# EAGLE design megamapper (EAGLE 6.5.0)
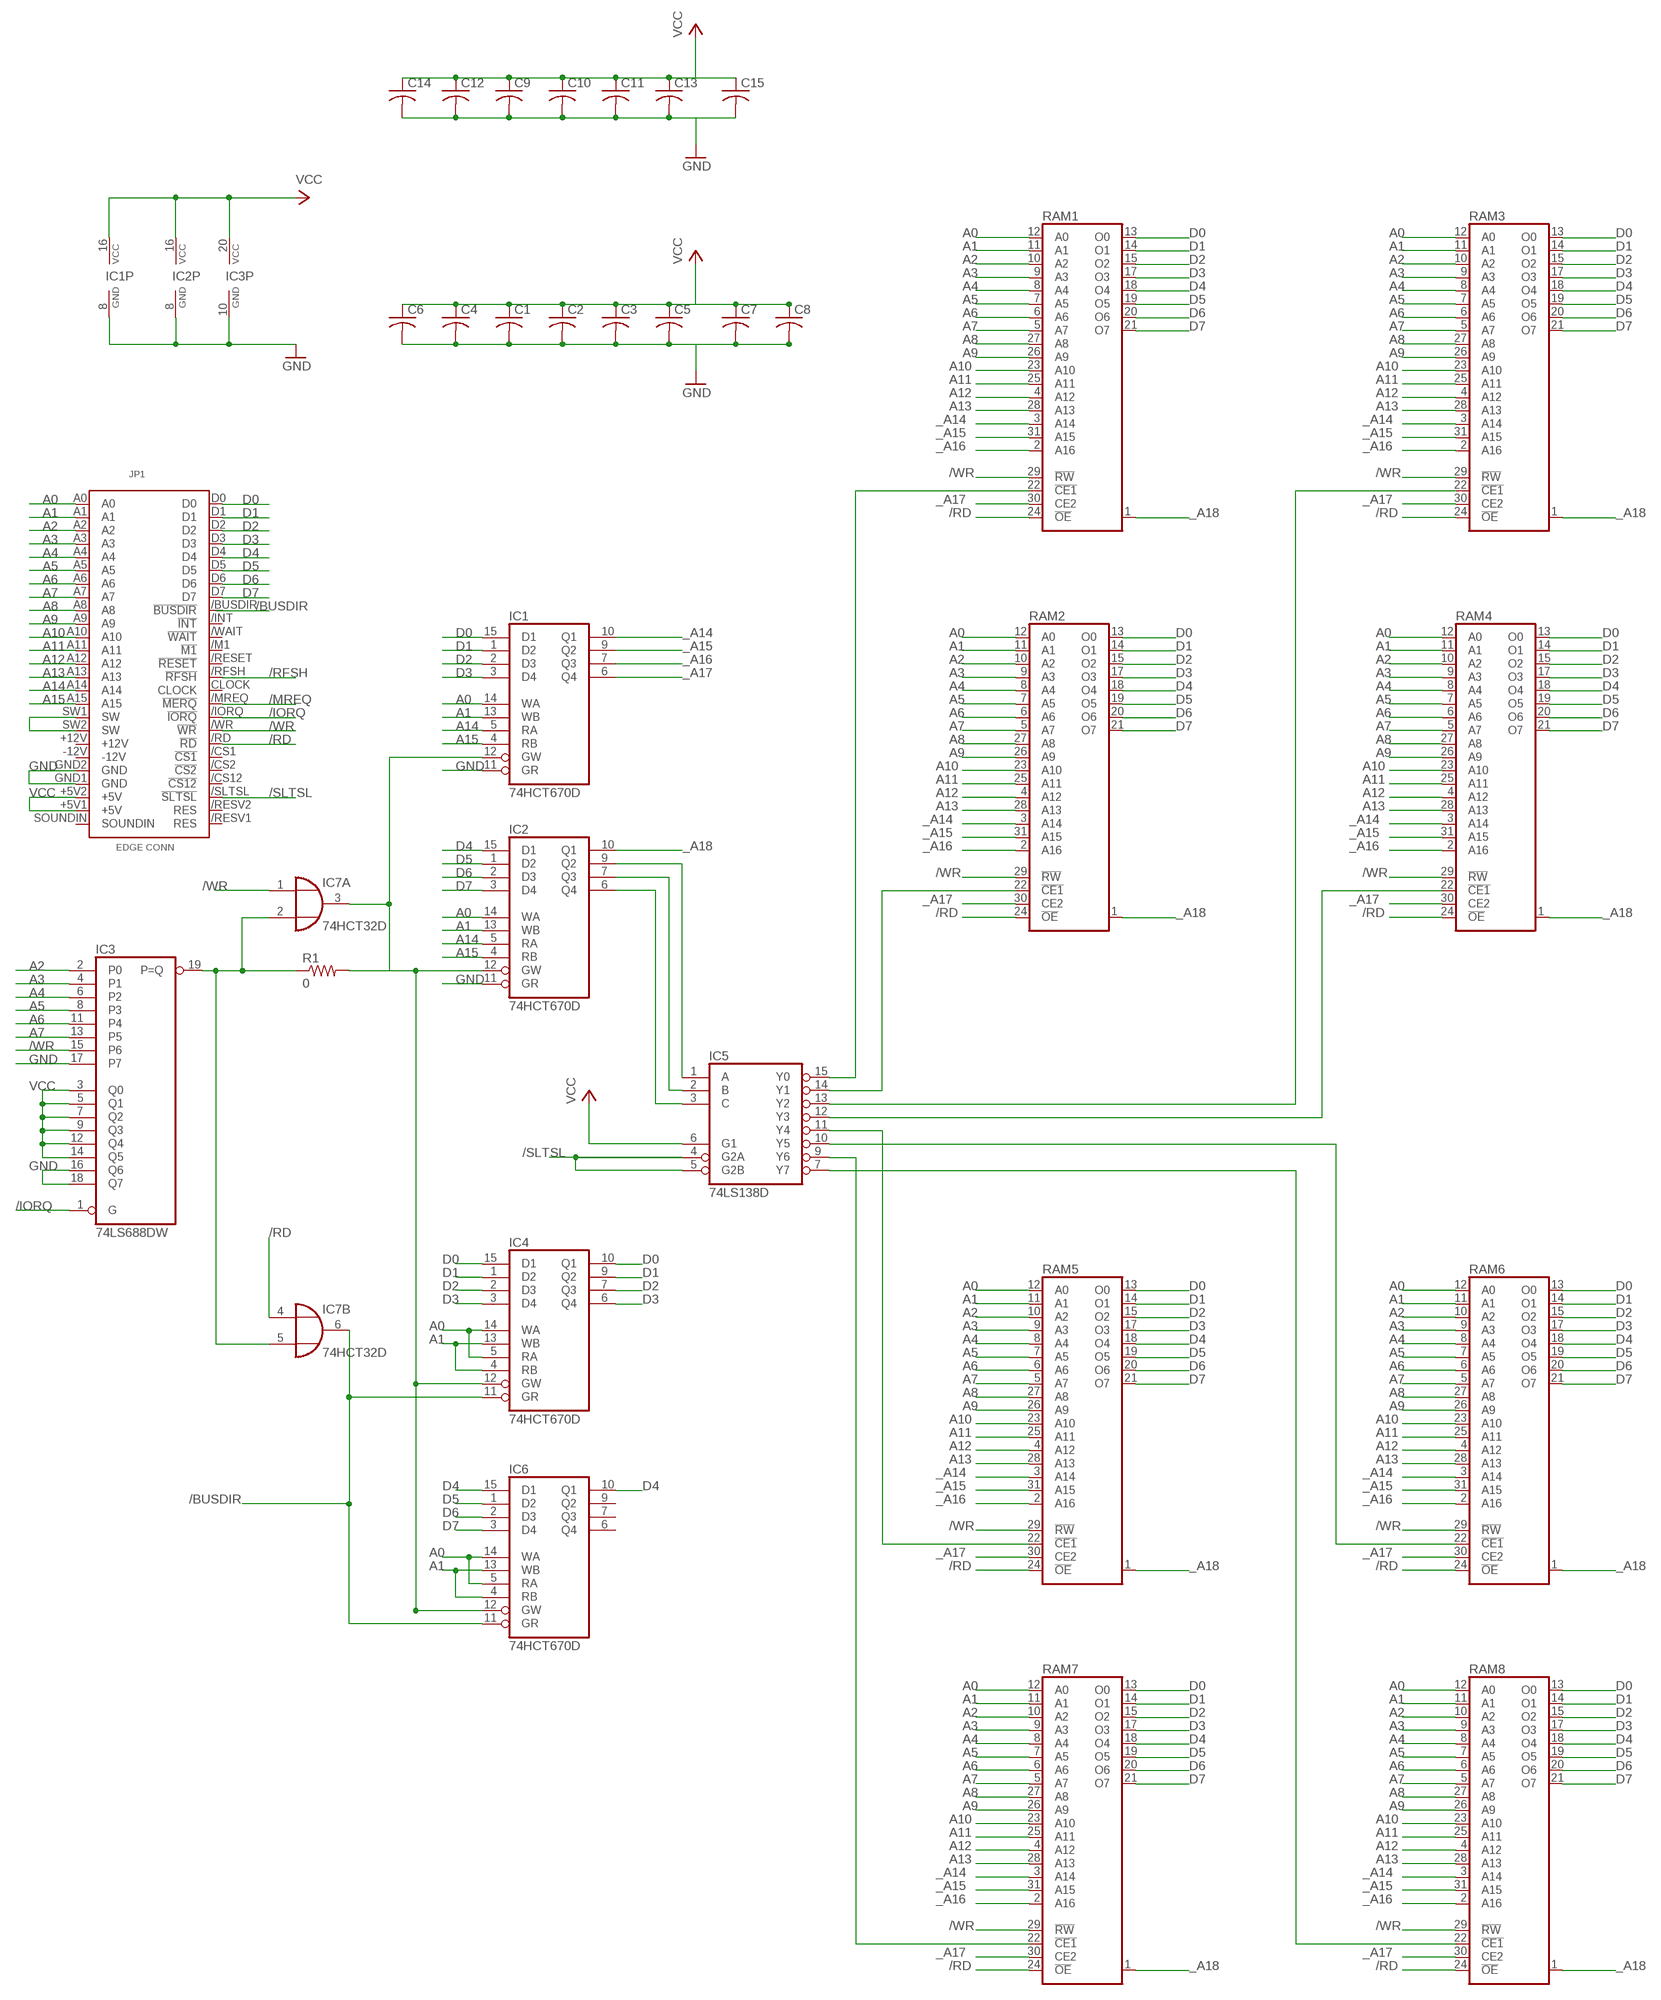
[diagram p0: schematic, sheet 1]

## Parts
C1  C-USC0805K  [C0805K]
C2  C-USC0805K  [C0805K]
C3  C-USC0805K  [C0805K]
C4  C-USC0805K  [C0805K]
C5  C-USC0805K  [C0805K]
C6  C-USC0805K  [C0805K]
C7  C-USC0805K  [C0805K]
C8  C-USC0805K  [C0805K]
C9  C-USC0805K  [C0805K]
C10  C-USC0805K  [C0805K]
C11  C-USC0805K  [C0805K]
C12  C-USC0805K  [C0805K]
C13  C-USC0805K  [C0805K]
C14  C-USC0805K  [C0805K]
C15  C-USC0805K  [C0805K]
IC1  74HCT670D  [SO16]
IC2  74HCT670D  [SO16]
IC3  74LS688DW  [SO20W]
IC4  74HCT670D  [SO16]
IC5  74LS138D  [SO16]
IC6  74HCT670D  [SO16]
IC7  74HCT32D  [SO14]
JP1  MSXCART  [MSXCART]
R1  0  R-US_R0805  [R0805]
RAM1  TC551001CF  [SOP32L]
RAM2  TC551001CF  [SOP32L]
RAM3  TC551001CF  [SOP32L]
RAM4  TC551001CF  [SOP32L]
RAM5  TC551001CF  [SOP32L]
RAM6  TC551001CF  [SOP32L]
RAM7  TC551001CF  [SOP32L]
RAM8  TC551001CF  [SOP32L]

## Nets
/BUSDIR: IC4.11(GR) IC6.11(GR) IC7.6(B:O)
/IORQ: IC3.1(G) JP1./IORQ(!IORQ)
/MREQ: JP1./MREQ(!MERQ)
/RD: IC7.4(B:I0) JP1./RD(!RD) RAM1.24(!OE) RAM2.24(!OE) RAM3.24(!OE) RAM4.24(!OE) RAM5.24(!OE) RAM6.24(!OE) RAM7.24(!OE) RAM8.24(!OE)
/RFSH: JP1./RFSH(!RFSH)
/SLTSL: IC5.4(G2A) IC5.5(G2B) JP1./SLTSL(!SLTSL)
/WR: IC3.15(P6) IC7.1(A:I0) JP1./WR(!WR) RAM1.29(!RW) RAM2.29(!RW) RAM3.29(!RW) RAM4.29(!RW) RAM5.29(!RW) RAM6.29(!RW) RAM7.29(!RW) RAM8.29(!RW)
_A14: IC1.10(Q1) RAM1.3(A14) RAM2.3(A14) RAM3.3(A14) RAM4.3(A14) RAM5.3(A14) RAM6.3(A14) RAM7.3(A14) RAM8.3(A14)
_A15: IC1.9(Q2) RAM1.31(A15) RAM2.31(A15) RAM3.31(A15) RAM4.31(A15) RAM5.31(A15) RAM6.31(A15) RAM7.31(A15) RAM8.31(A15)
_A16: IC1.7(Q3) RAM1.2(A16) RAM2.2(A16) RAM3.2(A16) RAM4.2(A16) RAM5.2(A16) RAM6.2(A16) RAM7.2(A16) RAM8.2(A16)
_A17: IC1.6(Q4) RAM1.30(CE2) RAM2.30(CE2) RAM3.30(CE2) RAM4.30(CE2) RAM5.30(CE2) RAM6.30(CE2) RAM7.30(CE2) RAM8.30(CE2)
_A18: IC2.10(Q1) RAM1.1(NC) RAM2.1(NC) RAM3.1(NC) RAM4.1(NC) RAM5.1(NC) RAM6.1(NC) RAM7.1(NC) RAM8.1(NC)
A0: IC1.14(WA) IC2.14(WA) IC4.5(RA) IC4.14(WA) IC6.5(RA) IC6.14(WA) JP1.A0 RAM1.12(A0) RAM2.12(A0) RAM3.12(A0) RAM4.12(A0) RAM5.12(A0) RAM6.12(A0) RAM7.12(A0) RAM8.12(A0)
A1: IC1.13(WB) IC2.13(WB) IC4.4(RB) IC4.13(WB) IC6.4(RB) IC6.13(WB) JP1.A1 RAM1.11(A1) RAM2.11(A1) RAM3.11(A1) RAM4.11(A1) RAM5.11(A1) RAM6.11(A1) RAM7.11(A1) RAM8.11(A1)
A2: IC3.2(P0) JP1.A2 RAM1.10(A2) RAM2.10(A2) RAM3.10(A2) RAM4.10(A2) RAM5.10(A2) RAM6.10(A2) RAM7.10(A2) RAM8.10(A2)
A3: IC3.4(P1) JP1.A3 RAM1.9(A3) RAM2.9(A3) RAM3.9(A3) RAM4.9(A3) RAM5.9(A3) RAM6.9(A3) RAM7.9(A3) RAM8.9(A3)
A4: IC3.6(P2) JP1.A4 RAM1.8(A4) RAM2.8(A4) RAM3.8(A4) RAM4.8(A4) RAM5.8(A4) RAM6.8(A4) RAM7.8(A4) RAM8.8(A4)
A5: IC3.8(P3) JP1.A5 RAM1.7(A5) RAM2.7(A5) RAM3.7(A5) RAM4.7(A5) RAM5.7(A5) RAM6.7(A5) RAM7.7(A5) RAM8.7(A5)
A6: IC3.11(P4) JP1.A6 RAM1.6(A6) RAM2.6(A6) RAM3.6(A6) RAM4.6(A6) RAM5.6(A6) RAM6.6(A6) RAM7.6(A6) RAM8.6(A6)
A7: IC3.13(P5) JP1.A7 RAM1.5(A7) RAM2.5(A7) RAM3.5(A7) RAM4.5(A7) RAM5.5(A7) RAM6.5(A7) RAM7.5(A7) RAM8.5(A7)
A8: JP1.A8 RAM1.27(A8) RAM2.27(A8) RAM3.27(A8) RAM4.27(A8) RAM5.27(A8) RAM6.27(A8) RAM7.27(A8) RAM8.27(A8)
A9: JP1.A9 RAM1.26(A9) RAM2.26(A9) RAM3.26(A9) RAM4.26(A9) RAM5.26(A9) RAM6.26(A9) RAM7.26(A9) RAM8.26(A9)
A10: JP1.A10 RAM1.23(A10) RAM2.23(A10) RAM3.23(A10) RAM4.23(A10) RAM5.23(A10) RAM6.23(A10) RAM7.23(A10) RAM8.23(A10)
A11: JP1.A11 RAM1.25(A11) RAM2.25(A11) RAM3.25(A11) RAM4.25(A11) RAM5.25(A11) RAM6.25(A11) RAM7.25(A11) RAM8.25(A11)
A12: JP1.A12 RAM1.4(A12) RAM2.4(A12) RAM3.4(A12) RAM4.4(A12) RAM5.4(A12) RAM6.4(A12) RAM7.4(A12) RAM8.4(A12)
A13: JP1.A13 RAM1.28(A13) RAM2.28(A13) RAM3.28(A13) RAM4.28(A13) RAM5.28(A13) RAM6.28(A13) RAM7.28(A13) RAM8.28(A13)
A14: IC1.5(RA) IC2.5(RA) JP1.A14
A15: IC1.4(RB) IC2.4(RB) JP1.A15
D0: IC1.15(D1) IC4.10(Q1) IC4.15(D1) JP1.D0 RAM1.13(O0) RAM2.13(O0) RAM3.13(O0) RAM4.13(O0) RAM5.13(O0) RAM6.13(O0) RAM7.13(O0) RAM8.13(O0)
D1: IC1.1(D2) IC4.1(D2) IC4.9(Q2) JP1.D1 RAM1.14(O1) RAM2.14(O1) RAM3.14(O1) RAM4.14(O1) RAM5.14(O1) RAM6.14(O1) RAM7.14(O1) RAM8.14(O1)
D2: IC1.2(D3) IC4.2(D3) IC4.7(Q3) JP1.D2 RAM1.15(O2) RAM2.15(O2) RAM3.15(O2) RAM4.15(O2) RAM5.15(O2) RAM6.15(O2) RAM7.15(O2) RAM8.15(O2)
D3: IC1.3(D4) IC4.3(D4) IC4.6(Q4) JP1.D3 RAM1.17(O3) RAM2.17(O3) RAM3.17(O3) RAM4.17(O3) RAM5.17(O3) RAM6.17(O3) RAM7.17(O3) RAM8.17(O3)
D4: IC2.15(D1) IC6.10(Q1) IC6.15(D1) JP1.D4 RAM1.18(O4) RAM2.18(O4) RAM3.18(O4) RAM4.18(O4) RAM5.18(O4) RAM6.18(O4) RAM7.18(O4) RAM8.18(O4)
D5: IC2.1(D2) IC6.1(D2) JP1.D5 RAM1.19(O5) RAM2.19(O5) RAM3.19(O5) RAM4.19(O5) RAM5.19(O5) RAM6.19(O5) RAM7.19(O5) RAM8.19(O5)
D6: IC2.2(D3) IC6.2(D3) JP1.D6 RAM1.20(O6) RAM2.20(O6) RAM3.20(O6) RAM4.20(O6) RAM5.20(O6) RAM6.20(O6) RAM7.20(O6) RAM8.20(O6)
D7: IC2.3(D4) IC6.3(D4) JP1.D7 RAM1.21(O7) RAM2.21(O7) RAM3.21(O7) RAM4.21(O7) RAM5.21(O7) RAM6.21(O7) RAM7.21(O7) RAM8.21(O7)
GND [GND]: C1.2 C2.2 C3.2 C4.2 C5.2 C6.2 C7.2 C8.2 C9.2 C10.2 C11.2 C12.2 C13.2 C14.2 C15.2 IC1.8(GND) IC1.11(GR) IC2.8(GND) IC2.11(GR) IC3.10(GND) IC3.16(Q6) IC3.17(P7) IC3.18(Q7) JP1.GND1(GND) JP1.GND2(GND)
N$1: IC1.12(GW) IC2.12(GW) IC4.12(GW) IC6.12(GW) IC7.3(A:O) R1.2
N$2: IC5.14(Y1) RAM2.22(!CE1)
N$3: IC5.13(Y2) RAM3.22(!CE1)
N$4: IC5.12(Y3) RAM4.22(!CE1)
N$5: IC5.11(Y4) RAM5.22(!CE1)
N$6: IC5.10(Y5) RAM6.22(!CE1)
N$7: JP1.SW1(SW) JP1.SW2(SW)
N$8: IC2.9(Q2) IC5.1(A)
N$9: IC2.7(Q3) IC5.2(B)
N$10: IC2.6(Q4) IC5.3(C)
N$11: IC5.9(Y6) RAM7.22(!CE1)
N$12: IC5.7(Y7) RAM8.22(!CE1)
N$13: IC3.19(P=Q) IC7.2(A:I1) IC7.5(B:I1) R1.1
N$26: IC5.15(Y0) RAM1.22(!CE1)
VCC [VCC]: C1.1 C2.1 C3.1 C4.1 C5.1 C6.1 C7.1 C8.1 C9.1 C10.1 C11.1 C12.1 C13.1 C14.1 C15.1 IC1.16(VCC) IC2.16(VCC) IC3.3(Q0) IC3.5(Q1) IC3.7(Q2) IC3.9(Q3) IC3.12(Q4) IC3.14(Q5) IC3.20(VCC) IC5.6(G1) JP1.+5V1(+5V) JP1.+5V2(+5V)
Unconnected: IC6.6(Q4) IC6.7(Q3) IC6.9(Q2) IC7.8(C:O) IC7.9(C:I0) IC7.10(C:I1) IC7.11(D:O) IC7.12(D:I0) IC7.13(D:I1) JP1.+12V JP1.-12V JP1./BUSDIR(!BUSDIR) JP1./CS1(!CS1) JP1./CS2(!CS2) JP1./CS12(!CS12) JP1./INT(!INT) JP1./M1(!M1) JP1./RESET(!RESET) JP1./RESV1(RES) JP1./RESV2(RES) JP1./WAIT(!WAIT) JP1.CLOCK JP1.SOUNDIN

## Power pins joined to a net without a drawn wire
GND: IC4.8(GND) IC5.8(GND) IC6.8(GND) IC7.7(P:GND) RAM1.16(GND) RAM2.16(GND) RAM3.16(GND) RAM4.16(GND) RAM5.16(GND) RAM6.16(GND) RAM7.16(GND) RAM8.16(GND)
VCC: IC4.16(VCC) IC5.16(VCC) IC6.16(VCC) IC7.14(P:VCC) RAM1.32(VCC) RAM2.32(VCC) RAM3.32(VCC) RAM4.32(VCC) RAM5.32(VCC) RAM6.32(VCC) RAM7.32(VCC) RAM8.32(VCC)

## Library data of the parts
C1-C15 = adafruit:C-US: CAPACITOR, American symbol
IC1 IC2 IC4 IC6 = 74xx-eu:74*670: 4 by 4 REGISTER FILES, 3-state
IC3 = 74xx-eu:74*688: 8-bit MAGNITUDE/IDENTITY COMPARATOR, totem pole
IC5 = 74xx-eu:74*138: 3-line to 8-line DECODER/DEMULTIPLEXER
IC7 = 74xx-eu:74*32: Quad 2-input OR gate
JP1 = msx-con:MSXCART
R1 = adafruit:R-US_: RESISTOR, American symbol
RAM1-RAM8 = memory:TC551001CF: MEMORY

## Net classes
1 GND: width 0.406 mm
2 VCC: width 0.406 mm

## Board
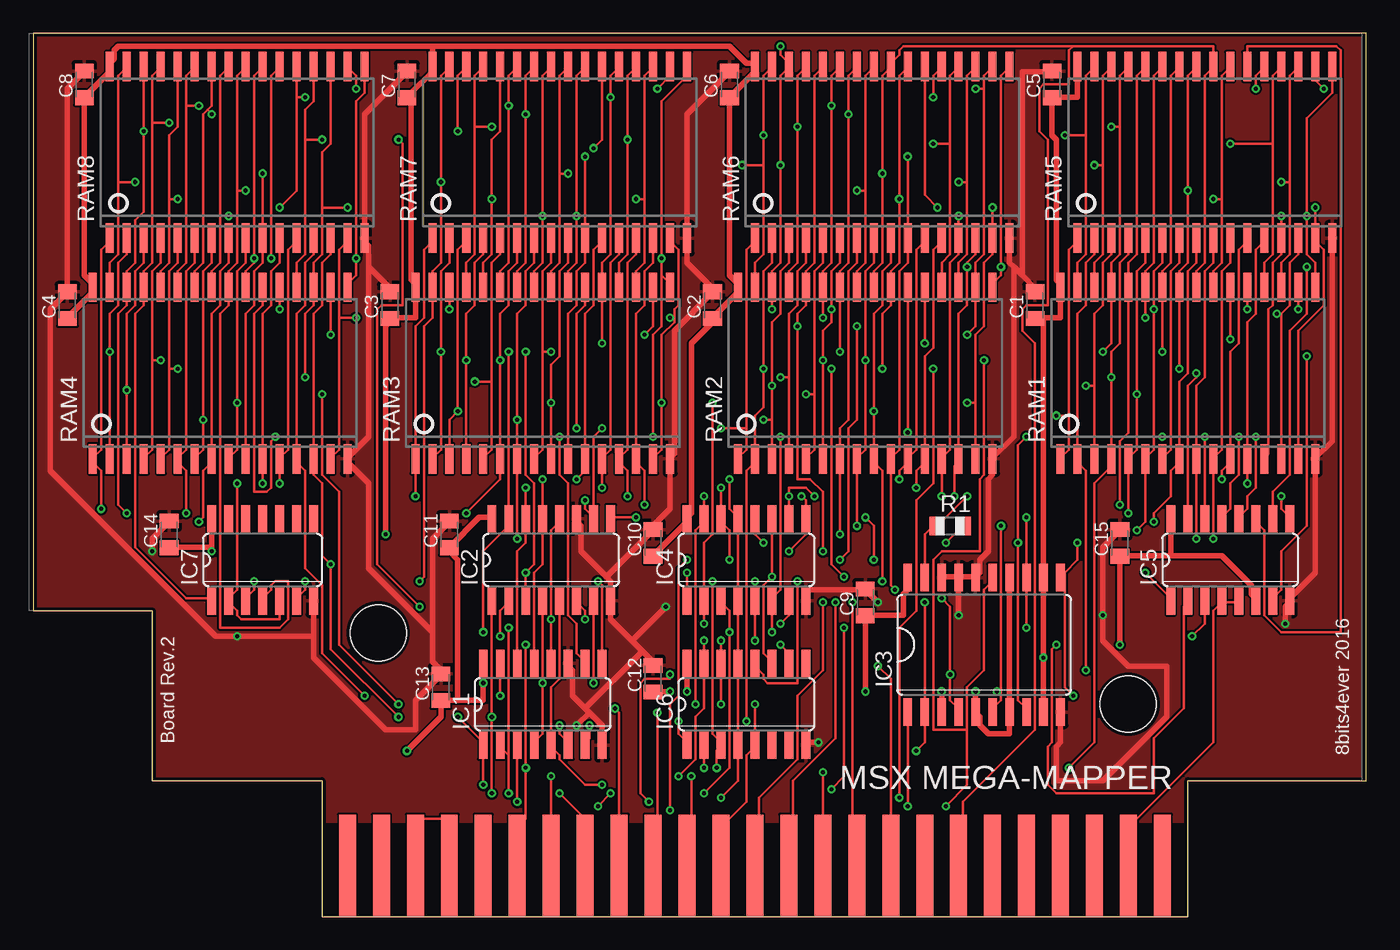
[diagram p1: board, top side]
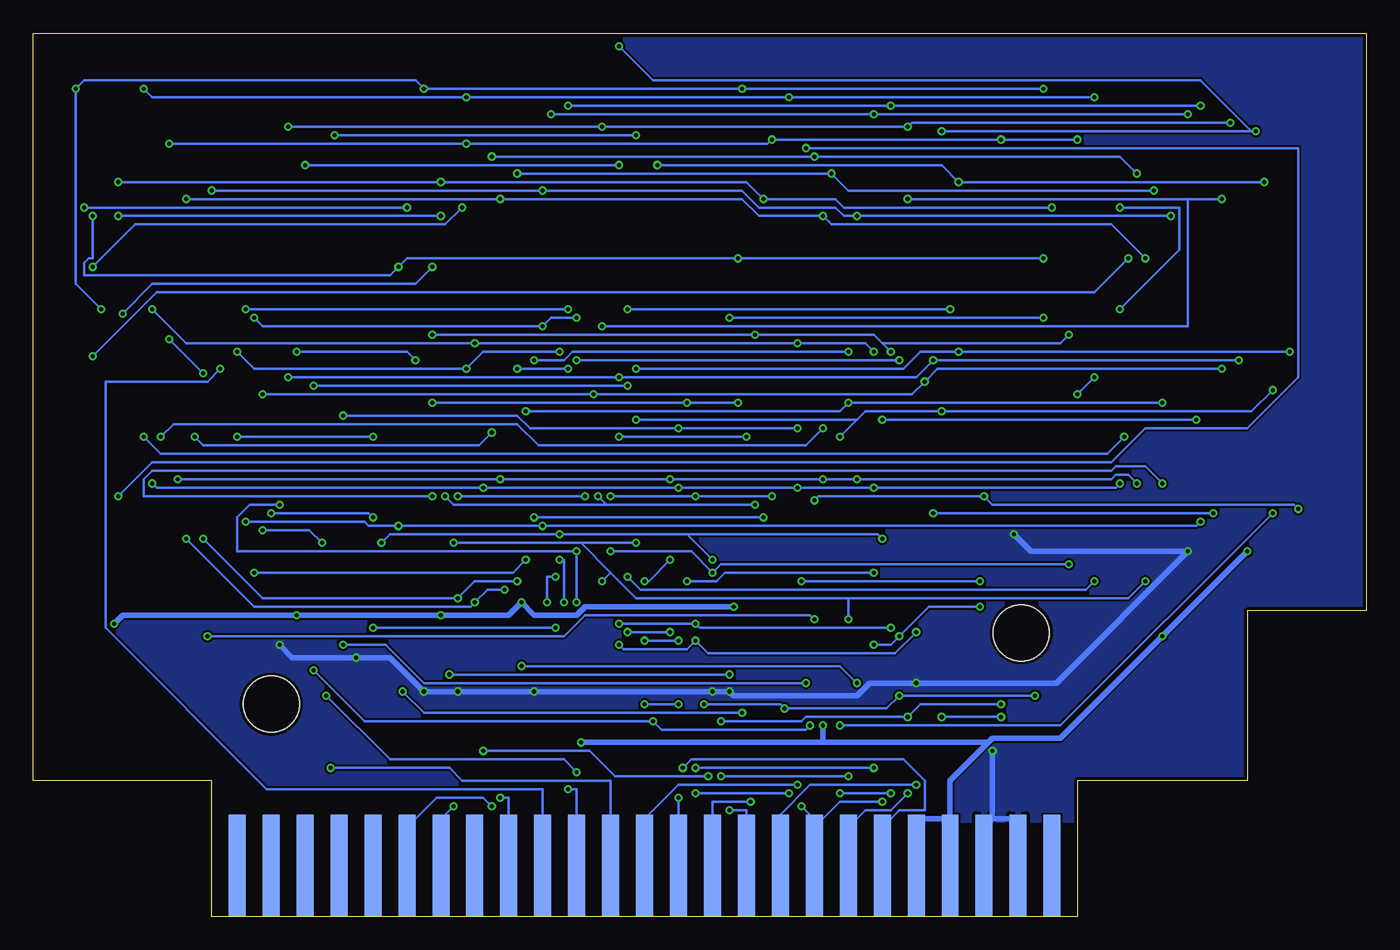
[diagram p2: board, bottom side, seen from below]

Size 99.69 x 66.04 mm. Coordinates in mm from the lower left corner, seen from the top.
Outline: 0,66.04 0,22.86 8.89,22.86 8.89,10.16 21.59,10.16 21.59,0 86.36,0 86.36,10.16 99.69,10.16 99.69,66.04 0,66.04
Copper layers (1*16): Top 0.035mm / dielectric 1.5mm / Bottom 0.035mm
Design rules "SeeedStudio_2layer_DRU_no_angle_20140221 *": minimum track width 7mil, minimum drill 12mil, track to track 6mil, track to pad 6mil, pad to pad 6mil, via to via 6mil, smd to smd 0mil, copper to edge 10mil, drill to drill 10mil, minimum pad ring 10mil, minimum via ring 6mil, stop-mask expansion 2mil, vias tented up to drill 100mil, thermal gap 10mil

### Footprints (pad centres in the part's own frame; a part is rotated, then mirrored left to right if it is on the bottom)
C0805K = smd 1.1 x 1.4: 1 -1,0; 2 1,0
SO16 = smd 0.66 x 2.032: 1 -4.445,-3.073; 2 -3.175,-3.073; 3 -1.905,-3.073; 4 -0.635,-3.073; 5 0.635,-3.073; 6 1.905,-3.073; 7 3.175,-3.073; 8 4.445,-3.073; 9 4.445,3.073; 10 3.175,3.073; 11 1.905,3.073; 12 0.635,3.073; 13 -0.635,3.073; 14 -1.905,3.073; 15 -3.175,3.073; 16 -4.445,3.073
SO20W = smd 0.66 x 2.032: 1 -5.715,-5.029; 2 -4.445,-5.029; 3 -3.175,-5.029; 4 -1.905,-5.029; 5 -0.635,-5.029; 6 0.635,-5.029; 7 1.905,-5.029; 8 3.175,-5.029; 9 4.445,-5.029; 10 5.715,-5.029; 11 5.715,5.029; 12 4.445,5.029; 13 3.175,5.029; 14 1.905,5.029; 15 0.635,5.029; 16 -0.635,5.029; 17 -1.905,5.029; 18 -3.175,5.029; 19 -4.445,5.029; 20 -5.715,5.029
SO14 = smd 0.66 x 2.032: 1 -3.81,-3.073; 2 -2.54,-3.073; 3 -1.27,-3.073; 4 0,-3.073; 5 1.27,-3.073; 6 2.54,-3.073; 7 3.81,-3.073; 8 3.81,3.073; 9 2.54,3.073; 10 1.27,3.073; 11 0,3.073; 12 -1.27,3.073; 13 -2.54,3.073; 14 -3.81,3.073
MSXCART = smd 1.27 x 7.62 bottom: +5V1 4.445,3.81; +5V2 6.985,3.81; /CS1 62.865,3.81; /CS12 60.325,3.81; /IORQ 50.165,3.81; /M1 52.705,3.81; /RESET 45.085,3.81; /RESV2 57.785,3.81; /WAIT 55.245,3.81; /WR 47.625,3.81; A1 29.845,3.81; A3 27.305,3.81; A5 24.765,3.81; A7 37.465,3.81; A9 42.545,3.81; A11 40.005,3.81; A12 34.925,3.81; A14 32.385,3.81; D1 22.225,3.81; D3 19.685,3.81; D5 17.145,3.81; D7 14.605,3.81; GND1 9.525,3.81; GND2 12.065,3.81; SOUNDIN 1.905,3.81 | smd 1.27 x 7.62: +12V 4.445,3.81; -12V 1.905,3.81; /BUSDIR 52.705,3.81; /CS2 62.865,3.81; /INT 55.245,3.81; /MREQ 50.165,3.81; /RD 47.625,3.81; /RESV1 45.085,3.81; /RFSH 57.785,3.81; /SLTSL 60.325,3.81; A0 29.845,3.81; A2 27.305,3.81; A4 24.765,3.81; A6 37.465,3.81; A8 34.925,3.81; A10 40.005,3.81; A13 32.385,3.81; A15 42.545,3.81; CLOCK 12.065,3.81; D0 22.225,3.81; D2 19.685,3.81; D4 17.145,3.81; D6 14.605,3.81; SW1 9.525,3.81; SW2 6.985,3.81 | hole 4.2: 60.312,15.887; 4.206,21.218
R0805 = smd 1.1 x 1.4: 1 -1,0; 2 1,0
SOP32L = smd 0.6 x 2.2: 1 -9.525,-6.416; 2 -8.255,-6.416; 3 -6.985,-6.416; 4 -5.715,-6.416; 5 -4.445,-6.416; 6 -3.175,-6.416; 7 -1.905,-6.416; 8 -0.635,-6.416; 9 0.635,-6.416; 10 1.905,-6.416; 11 3.175,-6.416; 12 4.445,-6.416; 13 5.715,-6.416; 14 6.985,-6.416; 15 8.255,-6.416; 16 9.525,-6.416; 17 9.525,6.416; 18 8.255,6.416; 19 6.985,6.416; 20 5.715,6.416; 21 4.445,6.416; 22 3.175,6.416; 23 1.905,6.416; 24 0.635,6.416; 25 -0.635,6.416; 26 -1.905,6.416; 27 -3.175,6.416; 28 -4.445,6.416; 29 -5.715,6.416; 30 -6.985,6.416; 31 -8.255,6.416; 32 -9.525,6.416

### Placement (x,y rotation side)
C1  74.93,45.72 90 top
C2  50.8,45.72 90 top
C3  26.67,45.72 90 top
C4  2.54,45.72 90 top
C5  76.2,62.23 90 top
C6  52.07,62.23 90 top
C7  27.94,62.23 90 top
C8  3.81,62.23 90 top
C9  62.23,23.5 90 top
C10  46.35,27.94 90 top
C11  31.11,28.57 90 top
C12  46.35,17.78 90 top
C13  30.48,17.14 90 top
C14  10.16,28.57 90 top
C15  81.28,27.94 90 top
IC1  38.1,15.88 0 top
IC2  38.73,26.67 0 top
IC3  71.12,20.32 0 top
IC4  53.34,26.67 0 top
IC5  89.53,26.67 0 top
IC6  53.34,15.88 0 top
IC7  17.14,26.67 0 top
JP1  21.59,0 0 top
R1  68.58,29.21 0 top
RAM1  86.36,40.64 0 top
RAM2  62.23,40.64 0 top
RAM3  38.1,40.64 0 top
RAM4  13.97,40.64 0 top
RAM5  87.63,57.15 0 top
RAM6  63.5,57.15 0 top
RAM7  39.37,57.15 0 top
RAM8  15.24,57.15 0 top

### Tracks (layer width: path | path; a pad name or v marks a point on that pad's centre or on a via)
/BUSDIR  (via drill 0.3)
  Top 0.178: v20.32,25.08 20.32,24.45 19.68,23.81 IC7.6 | IC4.11 v55.24,25.4 54.61,24.77 54.61,19.68 55.24,19.05 IC6.11
  Bottom 0.178: v20.32,25.08 20.95,24.45 54.29,24.45 v55.24,25.4
/IORQ  (via drill 0.3)
  Top 0.178: v65.41,8.26 IC3.1
  Bottom 0.178: v65.41,8.26 66.04,8.89 69.53,8.89 71.75,6.67 JP1./IORQ
/RD  (via drill 0.3)
  Top 0.178: IC7.4 17.14,23.81 17.78,24.45 17.78,24.77 18.1,25.08 19.05,25.08 19.05,22.23 18.41,21.59 13.97,21.59 13.97,45.09 14.61,45.72 RAM4.24 14.61,48.26 15.24,48.9 15.24,54.29 | 15.24,54.29 15.24,62.87 15.88,63.5 RAM8.24 | RAM3.24 38.73,48.26 39.37,48.9 39.37,55.56 | 39.37,55.56 39.37,62.87 40.01,63.5 RAM7.24 | RAM2.24 62.87,48.26 63.5,48.9 v63.5,55.56 63.5,62.87 64.14,63.5 RAM6.24 64.14,63.82 64.77,64.45 64.77,64.77 65.09,65.09 77.79,65.09 | v40.01,55.56 39.37,55.56 | RAM1.24 87,48.26 87.63,48.9 87.63,62.87 88.27,63.5 RAM5.24 88.27,65.09 77.79,65.09 | JP1./RD 69.53,4.13 69.53,8.57 74.93,13.97 74.93,42.86 73.98,43.81 73.98,45.4 74.3,45.72 75.88,45.72 75.88,58.1 75.25,58.74 75.25,61.91 75.56,62.23 77.47,62.23 77.47,64.77 77.79,65.09 | v15.88,54.29 15.24,54.29
  Bottom 0.178: v63.5,55.56 v40.01,55.56 38.73,54.29 v15.88,54.29
/SLTSL
  Top 0.178: 88.9,23.5 90.17,23.5 IC5.5 | 88.9,23.5 88.27,22.86 88.27,13.02 81.92,6.67 JP1./SLTSL | 88.9,23.5 IC5.4
/WR  (via drill 0.3)
  Top 0.178: IC7.1 13.34,23.81 11.43,23.81 7.62,27.62 7.62,45.09 8.26,45.72 RAM4.29 8.26,48.26 8.89,48.9 8.89,59.37 | 8.89,59.37 8.89,62.87 9.53,63.5 RAM8.29 | 69.85,13.97 69.85,9.84 v68.26,8.26 | 69.85,13.97 69.85,17.14 71.12,18.41 71.12,24.45 71.75,25.08 IC3.15 | 81.28,59.05 81.28,62.87 81.92,63.5 RAM5.29 | 81.28,59.05 81.28,49.53 80.64,48.9 RAM1.29 80.64,42.86 v80.01,42.23 | RAM3.29 32.38,48.9 33.02,49.53 33.02,59.05 | 33.02,59.05 33.02,62.87 33.66,63.5 RAM7.29 | RAM2.29 56.52,48.26 57.15,48.9 v57.15,59.05 57.15,62.87 57.78,63.5 RAM6.29 | v34.29,59.05 33.02,59.05 | v80.64,59.05 81.28,59.05 | 69.85,13.97 67.31,13.97 67.31,26.67 67.94,27.3 70.8,27.3 70.8,32.7 71.12,33.02 v71.12,41.59 | v10.16,59.37 8.89,59.37
  Bottom 0.178: v68.26,8.26 69.22,7.3 JP1./WR | v80.64,59.05 v57.15,59.05 v34.29,59.05 33.97,59.37 v10.16,59.37 | v71.12,41.59 71.75,42.23 v80.01,42.23
_A14  (via drill 0.3)
  Top 0.178: 79.38,39.69 79.38,45.09 80.01,45.72 80.01,48.9 80.64,49.53 RAM5.3 | 79.38,39.69 RAM1.3 | 55.24,37.15 v55.24,39.69 55.24,44.45 55.88,45.09 55.88,48.26 56.52,48.9 RAM6.3 | 55.24,37.15 RAM2.3 | RAM4.3 v6.99,39.37 6.99,45.09 7.62,45.72 7.62,48.26 8.26,48.9 RAM8.3 | v39.37,35.88 39.37,33.02 40.01,32.38 40.01,22.54 40.64,21.91 40.64,19.68 41.27,19.05 IC1.10 | RAM3.3 31.11,37.15 v31.75,37.78 31.75,49.85 32.38,50.48 RAM7.3 | v54.61,37.15 55.24,37.15 | v78.74,39.69 79.38,39.69
  Bottom 0.178: 38.1,37.15 37.47,37.78 v31.75,37.78 8.57,37.78 v6.99,39.37 | 38.1,37.15 v39.37,35.88 | 38.1,37.15 v54.61,37.15 | v55.24,39.69 v78.74,39.69
_A15  (via drill 0.3)
  Top 0.178: RAM1.31 78.11,48.9 78.74,49.53 78.74,58.42 | 78.74,58.42 78.74,62.87 79.38,63.5 RAM5.31 | RAM2.31 53.98,48.9 54.61,49.53 54.61,56.2 | 54.61,56.2 v54.61,58.42 54.61,62.87 55.24,63.5 RAM6.31 | RAM4.31 5.71,48.9 6.35,49.53 6.35,54.93 | 6.35,54.93 6.35,62.87 6.99,63.5 RAM8.31 | IC1.9 42.55,24.77 v42.23,25.08 | v28.89,25.08 29.21,25.4 29.21,44.13 29.84,44.77 RAM3.31 29.84,48.26 30.48,48.9 v30.48,54.93 30.48,62.87 31.11,63.5 RAM7.31 | v7.62,54.93 6.35,54.93 | v53.02,56.2 54.61,56.2 | v77.15,58.42 78.74,58.42
  Bottom 0.178: v28.89,25.08 v42.23,25.08 | v7.62,54.93 v30.48,54.93 31.75,56.2 v53.02,56.2 | v54.61,58.42 v77.15,58.42
_A16  (via drill 0.3)
  Top 0.178: RAM4.2 v5.71,42.23 5.71,45.09 6.35,45.72 6.35,48.9 6.99,49.53 RAM8.2 | RAM7.2 31.11,48.9 30.48,48.26 v30.48,42.23 30.48,34.92 29.84,34.29 RAM3.2 | RAM5.2 79.38,49.53 78.74,48.9 78.74,45.72 78.11,45.09 RAM1.2 78.11,33.97 78.74,33.34 v78.74,18.41 | v41.59,14.29 41.59,13.34 41.27,13.02 IC1.7 | v53.34,14.61 53.34,33.34 53.98,33.97 RAM2.2 53.98,37.47 54.61,38.1 v54.61,40.96 54.61,48.26 55.24,48.9 RAM6.2
  Bottom 0.178: v5.71,42.23 v30.48,42.23 33.34,42.23 34.61,40.96 v54.61,40.96 | v41.59,14.29 41.91,13.97 52.7,13.97 v53.34,14.61 74.93,14.61 v78.74,18.41
_A17  (via drill 0.3)
  Top 0.178: RAM1.30 79.38,48.9 80.01,49.53 80.01,56.2 | 80.01,56.2 80.01,62.87 80.64,63.5 RAM5.30 | v31.11,45.4 RAM3.30 | v55.24,45.4 RAM2.30 55.24,48.26 55.88,48.9 v55.88,56.2 55.88,62.87 56.52,63.5 RAM6.30 56.52,63.82 55.88,64.45 v55.88,65.09 | v79.38,56.2 80.01,56.2 | v39.37,14.29 39.37,13.65 40.01,13.02 IC1.6 | v6.99,30.16 6.35,30.8 6.35,45.09 6.99,45.72 RAM4.30 6.99,48.26 7.62,48.9 7.62,52.07 8.26,52.7 v8.26,58.74 RAM8.30 | v31.75,58.74 31.75,62.87 32.38,63.5 RAM7.30
  Bottom 0.178: v55.24,45.4 v31.11,45.4 | v55.88,56.2 v79.38,56.2 | v39.37,14.29 22.86,14.29 v6.99,30.16 | v8.26,58.74 8.57,58.74 | 8.57,58.74 v31.75,58.74 | v55.88,65.09 53.34,62.55 12.38,62.55 8.57,58.74
_A18  (via drill 0.3)
  Top 0.178: 77.47,37.47 77.47,49.85 78.11,50.48 RAM5.1 | 77.47,37.47 77.47,34.92 76.83,34.29 RAM1.1 | 53.34,36.51 53.34,49.85 53.98,50.48 RAM6.1 | 53.34,36.51 53.34,34.92 52.7,34.29 RAM2.1 | RAM8.1 5.71,50.48 5.08,49.85 5.08,34.92 4.45,34.29 RAM4.1 4.45,33.97 5.08,33.34 v5.08,30.48 | 41.91,29.84 41.27,30.48 v41.27,31.11 | v28.57,31.43 RAM3.1 28.57,44.13 29.21,44.77 29.21,49.85 29.84,50.48 RAM7.1 | v51.44,36.51 53.34,36.51 | v42.55,36.51 41.91,35.88 41.91,29.84 | 41.91,29.84 IC2.10 | v76.52,37.47 77.47,37.47
  Bottom 0.178: v41.27,31.11 40.96,31.43 v28.57,31.43 27.94,30.8 5.4,30.8 v5.08,30.48 | v42.55,36.51 v51.44,36.51 62.55,36.51 63.5,37.47 v76.52,37.47
A0  (via drill 0.3)
  Top 0.178: JP1.A0 51.44,6.67 53.34,8.57 53.34,12.06 53.98,12.7 IC6.5 v53.98,15.88 | RAM5.12 92.08,50.48 91.44,49.85 91.44,45.09 90.81,44.45 RAM1.12 v90.81,32.38 | RAM6.12 67.94,50.48 67.31,49.85 67.31,42.55 66.67,41.91 RAM2.12 66.67,33.97 66.04,33.34 v66.04,32.07 | RAM8.12 19.68,50.48 19.05,49.85 19.05,34.92 18.41,34.29 RAM4.12 v18.41,32.38 | v51.44,20.64 IC6.14 v51.44,15.88 | v53.98,20.64 IC4.5 v53.98,25.08 | v52.07,26.67 52.07,28.89 51.44,29.53 IC4.14 v51.44,32.07 | IC1.14 36.2,27.3 36.83,27.94 IC2.14 v36.83,32.07 | RAM7.12 43.81,49.53 43.18,48.9 43.18,34.92 42.55,34.29 RAM3.12 v42.55,32.07
  Bottom 0.178: v53.98,20.64 v51.44,20.64 | v52.07,26.67 53.66,25.08 v53.98,25.08 | v18.41,32.38 18.73,32.07 v36.83,32.07 v42.55,32.07 v51.44,32.07 v66.04,32.07 90.49,32.07 v90.81,32.38 | v51.44,15.88 v53.98,15.88
A1  (via drill 0.3)
  Top 0.178: v51.44,8.89 52.7,10.16 IC6.4 IC6.13 IC4.4 IC4.13 52.7,29.84 52.07,30.48 v52.07,32.7 | RAM5.11 90.81,50.48 90.17,49.85 90.17,42.86 89.53,42.23 RAM1.11 89.53,33.97 88.9,33.34 v88.9,32.7 | RAM6.11 66.67,50.48 66.04,49.85 66.04,34.92 65.41,34.29 RAM2.11 65.41,33.97 64.77,33.34 v64.77,32.7 | RAM8.11 18.41,48.9 17.78,48.26 17.78,45.72 17.14,45.09 RAM4.11 v17.14,32.38 | IC1.13 37.47,25.72 38.1,26.35 IC2.13 v38.1,32.7 | RAM7.11 42.55,50.48 41.91,49.85 41.91,45.72 41.27,45.09 RAM3.11 41.27,33.34 v40.64,32.7
  Bottom 0.178: v51.44,8.89 JP1.A1 | v17.14,32.38 17.78,33.02 18.73,33.02 19.05,32.7 v38.1,32.7 v40.64,32.7 v52.07,32.7 v64.77,32.7 v88.9,32.7
A2  (via drill 0.3)
  Top 0.178: RAM4.10 15.88,45.09 16.51,45.72 16.51,48.26 17.14,48.9 RAM8.10 v17.14,55.56 | RAM3.10 40.01,45.09 40.64,45.72 40.64,48.26 41.27,48.9 RAM7.10 v41.27,56.83 | RAM5.10 89.53,48.9 88.9,48.26 88.9,34.92 88.27,34.29 RAM1.10 v88.27,28.26 | v66.67,23.5 IC3.2 66.67,13.02 v66.04,12.38 | v64.45,24.45 64.14,24.77 RAM2.10 64.14,34.29 64.77,34.92 64.77,48.26 65.41,48.9 RAM6.10 v65.41,56.83 | JP1.A2 49.21,4.13 v49.21,10.48
  Bottom 0.178: v17.14,55.56 18.41,56.83 v41.27,56.83 v65.41,56.83 | v64.45,24.45 65.72,24.45 v66.67,23.5 66.99,23.18 83.19,23.18 v88.27,28.26 | v49.21,10.48 56.2,10.48 58.1,12.38 v66.04,12.38
A3  (via drill 0.3)
  Top 0.178: RAM8.9 15.88,48.9 15.24,48.26 v15.24,38.42 15.24,34.92 14.61,34.29 RAM4.9 | RAM3.9 v38.73,38.42 38.73,41.27 39.37,41.91 39.37,48.26 40.01,48.9 RAM7.9 | RAM5.9 88.27,48.9 87.63,48.26 87.63,40.32 87,39.69 RAM1.9 v87,28.26 | v67.94,23.81 68.58,23.18 v68.58,18.1 68.58,16.19 69.22,15.56 IC3.4 | v63.5,25.08 63.5,33.34 62.87,33.97 RAM2.9 v62.87,37.78 62.87,45.09 63.5,45.72 63.5,48.26 64.14,48.9 RAM6.9 | v46.04,8.57 45.4,9.21 45.4,17.46 45.72,17.78 47.62,17.78 v47.62,18.1
  Bottom 0.178: v15.24,38.42 v38.73,38.42 39.37,37.78 v62.87,37.78 | v63.5,25.08 66.67,25.08 v67.94,23.81 82.55,23.81 v87,28.26 | JP1.A3 48.9,8.57 v46.04,8.57 | v68.58,18.1 v47.62,18.1
A4  (via drill 0.3)
  Top 0.178: RAM5.8 87,48.9 86.36,48.26 86.36,40.64 85.72,40.01 RAM1.8 85.72,33.97 85.09,33.34 85.09,31.43 83.82,30.16 v83.82,29.53 | 38.1,42.23 38.1,48.26 38.73,48.9 RAM7.8 | 38.1,42.23 38.1,34.92 37.47,34.29 RAM3.8 | RAM8.8 14.61,48.9 13.97,48.26 13.97,45.72 13.34,45.09 RAM4.8 13.34,33.97 12.7,33.34 12.7,29.84 v12.38,29.53 | v72.39,29.21 72.39,16.83 | 72.39,16.83 72.39,16.19 71.75,15.56 IC3.6 | v61.59,29.21 RAM2.8 61.59,34.29 62.23,34.92 v62.23,41.59 62.23,48.26 62.87,48.9 RAM6.8 | JP1.A4 46.67,4.13 v46.67,15.24 | 72.39,16.83 v72.07,16.83 | v38.73,42.23 38.1,42.23
  Bottom 0.178: v46.67,15.24 70.48,15.24 v72.07,16.83 | v12.38,29.53 12.7,29.21 v61.59,29.21 v72.39,29.21 74.61,29.21 74.93,29.53 v83.82,29.53 | v38.73,42.23 59.37,42.23 60.01,41.59 v62.23,41.59
A5  (via drill 0.3)
  Top 0.178: RAM8.7 13.34,48.9 12.7,48.26 v12.7,37.15 12.7,34.92 12.06,34.29 RAM4.7 | RAM7.7 37.47,48.9 36.83,48.26 36.83,45.72 36.2,45.09 v36.2,37.15 RAM3.7 v36.2,28.26 | 85.09,35.88 85.09,48.26 85.72,48.9 RAM5.7 | 85.09,35.88 85.09,34.92 84.45,34.29 RAM1.7 | v60.33,28.57 RAM2.7 60.33,36.51 60.96,37.15 60.96,48.26 61.59,48.9 RAM6.7 | IC3.8 74.3,15.56 73.66,16.19 v73.66,27.94 73.66,35.24 v74.3,35.88 | v47.62,7.94 47.62,15.88 48.26,16.51 48.26,26.04 v48.9,26.67 | v84.45,35.88 85.09,35.88
  Bottom 0.178: v36.2,37.15 v12.7,37.15 | v73.66,27.94 73.03,28.57 v60.33,28.57 50.8,28.57 | JP1.A5 46.35,7.94 v47.62,7.94 | 50.8,28.57 v48.9,26.67 | v74.3,35.88 v84.45,35.88 | v36.2,28.26 36.51,28.57 50.8,28.57
A6  (via drill 0.3)
  Top 0.178: RAM2.6 v59.05,41.59 59.05,43.81 59.69,44.45 v59.69,45.4 59.69,48.26 60.33,48.9 RAM6.6 | RAM8.6 12.06,48.9 11.43,48.26 11.43,34.92 10.79,34.29 RAM4.6 10.79,33.97 11.43,33.34 v11.43,30.16 | RAM7.6 36.2,48.9 35.56,48.26 35.56,45.72 34.92,45.09 v34.92,41.59 RAM3.6 34.92,32.7 v32.38,30.16 | 77.15,25.72 78.11,26.67 v78.11,27.94 | 77.15,25.72 76.83,25.4 IC3.11 77.15,25.72 | v82.55,28.89 83.19,29.53 RAM1.6 83.19,34.29 83.82,34.92 v83.82,45.4 83.82,48.26 84.45,48.9 RAM5.6 | v59.05,10.79 JP1.A6 | v77.79,16.51 77.15,17.14 77.15,25.72
  Bottom 0.178: v32.38,30.16 v11.43,30.16 | v34.92,41.59 v59.05,41.59 | v78.11,27.94 79.06,28.89 v82.55,28.89 | v59.05,10.79 60.01,11.75 73.03,11.75 v77.79,16.51 | v83.82,45.4 v59.69,45.4
A7  (via drill 0.3)
  Top 0.178: 58.42,39.05 58.42,48.26 59.05,48.9 RAM6.5 | 58.42,39.05 58.42,34.92 57.78,34.29 RAM2.5 | 10.16,40.96 10.16,48.26 10.79,48.9 RAM8.5 | 10.16,40.96 10.16,34.92 9.53,34.29 RAM4.5 | 34.29,40.01 34.29,48.9 34.92,49.53 RAM7.5 | 34.29,40.01 34.29,34.92 33.66,34.29 RAM3.5 | v10.79,40.96 10.16,40.96 | 34.29,40.01 v33.02,40.01 | v57.78,39.05 58.42,39.05 | v74.3,29.84 IC3.13 v74.3,21.59 | v81.92,30.16 RAM1.5 81.92,34.29 82.55,34.92 v82.55,39.05 82.55,48.26 83.19,48.9 RAM5.5 | v59.69,9.53 60.64,10.48 v60.64,21.59
  Bottom 0.178: v10.79,40.96 32.07,40.96 v33.02,40.01 33.97,39.05 v57.78,39.05 v82.55,39.05 | v74.3,29.84 74.61,30.16 v81.92,30.16 | JP1.A7 59.05,9.53 v59.69,9.53 | v74.3,21.59 v60.64,21.59
A8  (via drill 0.3)
  Top 0.178: RAM4.27 10.79,48.26 11.43,48.9 11.43,60.64 | 11.43,60.64 11.43,62.87 12.06,63.5 RAM8.27 | RAM3.27 34.92,48.26 35.56,48.9 v35.56,60.64 35.56,62.87 36.2,63.5 RAM7.27 | v12.38,60.64 11.43,60.64 | RAM5.27 84.45,63.5 83.82,62.87 83.82,48.9 83.19,48.26 RAM1.27 v83.19,44.77 | RAM6.27 60.33,63.5 59.69,62.87 v59.69,60.64 59.69,48.9 59.05,48.26 RAM2.27 v59.05,44.77 | JP1.A8 56.83,4.13 56.83,10.16 60.01,13.34 v60.01,23.5 | v60.33,26.67 60.96,27.3 60.96,36.51 61.59,37.15 v61.59,44.13
  Bottom 0.178: v12.38,60.64 v35.56,60.64 v59.69,60.64 | v60.01,23.5 60.01,26.67 v60.33,26.67 | v59.05,44.77 60.96,44.77 v61.59,44.13 82.55,44.13 v83.19,44.77
A9  (via drill 0.3)
  Top 0.178: RAM4.26 12.06,48.26 12.7,48.9 12.7,60.01 13.02,60.33 | 13.02,60.33 13.34,60.64 RAM8.26 | RAM3.26 36.2,48.26 36.83,48.9 v36.83,60.01 36.83,62.87 37.47,63.5 RAM7.26 | v13.34,60.01 13.02,60.33 | RAM5.26 85.72,63.5 85.09,62.87 85.09,48.9 84.45,48.26 RAM1.26 v84.45,42.23 | RAM6.26 61.59,63.5 60.96,62.87 v60.96,60.01 60.96,48.9 60.33,48.26 RAM2.26 v60.33,42.23 | v64.77,8.89 64.77,21.59 66.04,22.86 66.04,31.11 67.31,32.38 v67.31,40.96
  Bottom 0.178: v13.34,60.01 v36.83,60.01 v60.96,60.01 | JP1.A9 64.14,8.89 v64.77,8.89 | v60.33,42.23 66.04,42.23 v67.31,40.96 83.19,40.96 v84.45,42.23
A10  (via drill 0.3)
  Top 0.178: RAM6.23 65.41,63.5 64.77,62.87 v64.77,53.66 64.77,48.9 64.14,48.26 RAM2.23 64.14,45.72 63.5,45.09 v63.5,40.96 | JP1.A10 61.28,4.13 v61.28,23.5 | v60.64,25.4 59.69,26.35 v59.69,40.96 | RAM1.23 88.27,48.26 88.9,48.9 88.9,53.66 | 88.9,53.66 88.9,62.87 89.53,63.5 RAM5.23 | RAM4.23 15.88,48.26 16.51,48.9 v16.51,49.21 16.51,62.87 17.14,63.5 RAM8.23 | RAM3.23 40.01,48.26 40.64,48.9 v40.64,52.39 40.64,62.87 41.27,63.5 RAM7.23 | v88.27,53.66 88.9,53.66
  Bottom 0.178: v61.28,23.5 61.28,25.4 v60.64,25.4 | v63.5,40.96 v59.69,40.96 | v16.51,49.21 19.05,51.75 40.01,51.75 v40.64,52.39 45.4,52.39 46.67,53.66 v64.77,53.66 v88.27,53.66
A11  (via drill 0.3)
  Top 0.178: RAM2.25 61.59,48.26 62.23,48.9 62.23,54.29 | 62.23,54.29 62.23,62.87 62.87,63.5 RAM6.25 | RAM4.25 13.34,48.26 13.97,48.9 13.97,52.39 | 13.97,52.39 13.97,62.87 14.61,63.5 RAM8.25 | RAM3.25 37.47,48.26 38.1,48.9 v38.1,52.39 38.1,62.87 38.73,63.5 RAM7.25 | v14.61,52.39 13.97,52.39 | v61.59,54.29 62.23,54.29 | RAM5.25 87,63.5 86.36,62.87 v86.36,54.29 86.36,48.9 85.72,48.26 RAM1.25 v85.72,40.96
  Bottom 0.178: v14.61,52.39 v38.1,52.39 39.05,52.39 39.69,53.02 45.4,53.02 46.67,54.29 v61.59,54.29 v86.36,54.29 | JP1.A11 61.59,9.53 82.23,9.53 94.3,21.59 94.3,40.01 86.68,40.01 v85.72,40.96
A12  (via drill 0.3)
  Top 0.178: 56.52,40.32 56.52,45.09 57.15,45.72 57.15,48.26 57.78,48.9 RAM6.4 | 56.52,40.32 RAM2.4 | 8.89,41.59 8.89,48.26 9.53,48.9 RAM8.4 | 8.89,41.59 8.89,34.92 8.26,34.29 RAM4.4 | RAM3.4 v32.38,41.59 32.38,45.09 33.02,45.72 33.02,48.9 33.66,49.53 RAM7.4 | v9.53,41.59 8.89,41.59 | v55.88,40.32 56.52,40.32 | RAM5.4 81.92,49.53 81.28,48.9 81.28,42.86 80.64,42.23 v80.64,40.32 RAM1.4 80.64,33.66 79.38,32.38 79.38,13.02 v77.47,11.11
  Bottom 0.178: v9.53,41.59 v32.38,41.59 33.66,40.32 v55.88,40.32 v80.64,40.32 | JP1.A12 56.52,10.16 67.63,10.16 68.58,11.11 v77.47,11.11
A13  (via drill 0.3)
  Top 0.178: RAM4.28 9.53,48.26 10.16,48.9 10.16,53.66 | 10.16,53.66 10.16,58.42 10.79,59.05 RAM8.28 | RAM3.28 33.66,48.9 34.29,49.53 v34.29,53.66 34.29,58.1 34.92,58.74 RAM7.28 | v10.79,53.66 10.16,53.66 | RAM5.28 83.19,63.5 82.55,62.87 82.55,49.53 81.92,48.9 RAM1.28 81.92,36.2 81.28,35.56 v81.28,30.8 | RAM6.28 59.05,63.5 58.42,62.87 58.42,48.9 57.78,48.26 RAM2.28 57.78,45.72 57.15,45.09 v57.15,44.13 57.15,32.7 58.1,32.7 59.05,31.75 v59.05,27.3 | JP1.A13 54.29,4.13 54.29,8.89 57.15,11.75 57.15,16.51 59.05,18.41 v59.05,23.5
  Bottom 0.178: v34.29,53.66 13.34,53.66 | 13.34,53.66 v10.79,53.66 | v59.05,23.5 v59.05,27.3 84.45,27.3 84.45,29.84 83.5,30.8 v81.28,30.8 | 13.34,53.66 13.34,44.13 v57.15,44.13
A14  (via drill 0.3)
  Top 0.178: IC2.5 39.37,17.78 38.73,17.14 IC1.5 38.73,12.7 39.37,12.06 39.37,11.75 41.27,9.84 v42.55,9.84
  Bottom 0.178: v42.55,9.84 51.44,9.84 53.98,7.3 JP1.A14
A15  (via drill 0.3)
  Top 0.178: IC2.4 v38.1,17.46 38.1,13.65 37.47,13.02 IC1.4 | v63.18,18.73 64.14,17.78 JP1.A15
  Bottom 0.178: v38.1,17.46 39.37,18.73 v63.18,18.73
D0  (via drill 0.3)
  Top 0.178: RAM1.13 92.08,34.29 92.39,34.61 92.39,45.4 92.71,45.72 92.71,48.9 93.34,49.53 RAM5.13 v93.34,52.39 | RAM7.13 45.09,49.53 44.45,48.9 44.45,34.92 43.81,34.29 RAM3.13 43.81,33.97 44.45,33.34 v44.45,31.43 | RAM8.13 20.95,49.53 20.32,48.9 20.32,45.72 19.68,45.09 RAM4.13 19.68,33.97 20.32,33.34 20.32,26.04 21.59,24.77 21.59,19.68 v24.77,16.51 | v34.92,16.51 IC1.15 | v43.5,15.56 43.81,15.24 JP1.D0 | v49.53,15.88 49.53,28.89 50.16,29.53 IC4.15 v50.16,31.43 | IC4.10 v56.52,31.43 56.52,32.07 57.78,32.07 v58.42,31.43 | v67.94,31.43 RAM2.13 67.94,34.29 68.58,34.92 68.58,48.9 69.22,49.53 RAM6.13 v69.22,52.39
  Bottom 0.178: v49.53,15.88 43.81,15.88 v43.5,15.56 35.88,15.56 v34.92,16.51 v24.77,16.51 | v56.52,31.43 v50.16,31.43 v44.45,31.43 | v58.42,31.43 v67.94,31.43 | v69.22,52.39 v93.34,52.39
D1  (via drill 0.3)
  Top 0.178: v33.66,9.84 IC1.1 33.66,13.02 v31.75,14.92 | 93.34,45.09 RAM1.14 | 93.34,45.09 93.98,45.72 93.98,48.9 94.61,49.53 RAM5.14 | RAM6.14 70.48,49.53 69.85,48.9 v69.85,48.58 69.85,45.72 69.22,45.09 RAM2.14 69.22,33.97 68.9,33.66 v68.9,31.43 | RAM7.14 46.35,48.9 45.72,48.26 45.72,45.72 45.09,45.09 RAM3.14 45.09,33.97 45.72,33.34 v45.72,30.8 | v48.9,25.72 IC4.1 | v56.52,27.3 57.78,28.57 IC4.9 57.78,31.11 v57.47,31.43 | RAM8.14 22.23,49.53 21.59,48.9 21.59,45.72 20.95,45.09 RAM4.14 20.95,33.02 21.59,32.38 21.59,26.99 v22.23,26.35 22.23,20 v27.3,14.92 | v93.03,45.09 93.34,45.09
  Bottom 0.178: v33.66,9.84 41.59,9.84 43.81,7.62 JP1.D1 | v56.52,27.3 50.48,27.3 v48.9,25.72 48.26,26.35 v22.23,26.35 | 56.83,30.8 v45.72,30.8 | v57.47,31.43 56.83,30.8 | v68.9,31.43 68.26,30.8 56.83,30.8 | v93.03,45.09 90.81,47.31 71.12,47.31 v69.85,48.58 | v27.3,14.92 v31.75,14.92
D2  (via drill 0.3)
  Top 0.178: v50.16,21.91 IC4.2 50.16,27.94 50.8,28.57 v50.8,38.42 | v55.88,21.91 56.52,22.54 IC4.7 | 35.56,12.06 34.92,12.7 IC1.2 | v35.56,9.21 35.56,12.06 | v39.37,9.21 41.27,7.3 JP1.D2 | 35.56,12.06 v35.56,21.59 | RAM1.15 94.61,43.81 96.52,45.72 96.52,49.85 95.89,50.48 RAM5.15 v95.89,53.02 | 70.48,38.42 70.48,43.5 71.12,44.13 71.12,48.9 71.75,49.53 RAM6.15 v71.75,53.02 | 70.48,38.42 RAM2.15 | 22.86,44.77 22.86,49.85 23.5,50.48 RAM8.15 | 22.86,44.77 22.86,34.92 22.23,34.29 RAM4.15 | 47.94,44.77 47.94,45.4 48.26,45.72 48.26,49.85 47.62,50.48 RAM7.15 | 47.94,44.77 47.94,44.45 46.99,43.5 v46.99,38.42 46.99,34.92 46.35,34.29 RAM3.15 | v24.13,44.77 22.86,44.77 | 47.94,44.77 v47.62,44.77 | v69.85,38.42 70.48,38.42
  Bottom 0.178: v55.88,21.91 v50.16,21.91 49.85,21.59 v35.56,21.59 | v39.37,9.21 v35.56,9.21 | v47.62,44.77 v24.13,44.77 | v46.99,38.42 v50.8,38.42 v69.85,38.42 | v71.75,53.02 v95.89,53.02
D3  (via drill 0.3)
  Top 0.178: v36.2,8.57 IC1.3 | RAM1.17 95.89,48.9 95.25,49.53 v95.25,52.39 95.25,59.69 97.16,61.59 RAM5.17 | RAM2.17 71.75,47.31 72.39,47.94 v72.39,48.58 72.39,62.87 73.03,63.5 RAM6.17 | RAM8.17 24.77,61.59 24.13,60.96 v24.13,49.21 24.13,47.94 23.5,47.31 RAM4.17 | v55.24,21.27 IC4.6 55.24,23.81 55.88,24.45 v55.88,35.88 | IC4.3 51.44,23.5 52.07,22.86 v52.07,21.27 52.07,11.11 v50.16,9.21 | 46.99,47.94 47.62,47.31 RAM3.17 | 46.99,47.94 v46.99,49.21 46.99,60.96 48.9,62.87 RAM7.17 | v46.35,35.88 46.35,43.5 46.99,44.13 46.99,47.94 | v43.18,9.21 v42.23,8.26
  Bottom 0.178: v36.2,8.57 39.37,8.57 40.96,6.99 | 40.96,6.99 41.27,6.67 JP1.D3 40.96,6.99 | v55.24,21.27 v52.07,21.27 | v46.35,35.88 v55.88,35.88 | v24.13,49.21 v46.99,49.21 71.75,49.21 v72.39,48.58 73.03,47.94 95.89,47.94 95.89,48.9 95.57,49.21 95.25,49.21 v95.25,52.39 | v42.23,8.26 40.96,6.99 | v50.16,9.21 v43.18,9.21
D4  (via drill 0.3)
  Top 0.178: v50.16,20.64 IC6.15 50.16,15.56 49.53,14.92 49.53,11.75 v48.26,10.48 | v55.88,20.32 56.52,19.68 IC6.10 | v35.56,42.23 IC2.15 35.56,29.21 33.66,27.3 v33.66,21.27 | v45.72,43.5 46.35,44.13 RAM3.18 | v22.23,43.5 RAM4.18 | v38.73,10.48 JP1.D4 | v94.61,45.4 RAM1.18 | v96.52,61.91 95.89,62.55 RAM5.18 | 71.12,61.91 71.12,62.87 71.75,63.5 RAM6.18 | 71.12,61.91 71.12,49.53 70.48,48.9 RAM2.18 70.48,44.13 v69.85,43.5 | v24.13,61.91 24.13,62.87 23.5,63.5 RAM8.18 | v46.67,61.91 47.62,62.87 RAM7.18 | v70.48,61.91 71.12,61.91
  Bottom 0.178: v55.88,20.32 55.56,20 50.8,20 v50.16,20.64 49.21,19.68 35.24,19.68 v33.66,21.27 | 36.2,42.86 36.83,43.5 v45.72,43.5 v69.85,43.5 | 36.2,42.86 v35.56,42.23 | v22.23,43.5 22.86,42.86 36.2,42.86 | v48.26,10.48 v38.73,10.48 | v94.61,45.4 96.52,47.31 v96.52,61.91 95.89,62.55 71.12,62.55 v70.48,61.91 v46.67,61.91 v24.13,61.91
D5  (via drill 0.3)
  Top 0.178: v34.29,9.21 v34.29,14.92 IC2.1 | v48.26,14.61 48.26,13.65 48.9,13.02 IC6.1 | RAM1.19 93.34,48.9 93.98,49.53 93.98,54.93 | 93.98,54.93 93.98,62.87 94.61,63.5 RAM5.19 | RAM2.19 69.22,48.9 69.85,49.53 69.85,54.93 | 69.85,54.93 69.85,62.87 70.48,63.5 RAM6.19 | 21.59,53.02 21.59,57.15 22.23,57.78 RAM8.19 | 21.59,53.02 21.59,49.53 20.95,48.9 RAM4.19 20.95,45.72 20.32,45.09 v20.32,40.32 | RAM3.19 45.09,48.26 45.72,48.9 45.72,53.66 | 45.72,53.66 45.72,62.87 46.35,63.5 RAM7.19 | v23.5,53.02 21.59,53.02 | 45.72,53.66 v45.09,53.66 | v69.22,54.93 69.85,54.93 | v93.34,54.93 93.98,54.93 | v27.3,15.88 22.86,20.32 22.86,31.75 21.59,33.02 v21.59,39.05
  Bottom 0.178: v34.29,9.21 35.56,7.94 37.47,7.94 38.73,6.67 JP1.D5 | v48.26,14.61 42.23,14.61 41.91,14.92 v34.29,14.92 33.34,15.88 v27.3,15.88 | v23.5,53.02 39.05,53.02 39.69,53.66 v45.09,53.66 46.35,54.93 v69.22,54.93 v93.34,54.93 | v20.32,40.32 v21.59,39.05
D6  (via drill 0.3)
  Top 0.178: v34.92,20.95 34.92,22.86 35.56,23.5 IC2.2 | v36.83,20.32 v36.83,11.11 36.83,7.3 36.2,6.67 JP1.D6 | v50.16,11.11 IC6.2 | RAM1.20 92.08,48.9 92.71,49.53 92.71,57.78 | 92.71,57.78 92.71,62.87 93.34,63.5 RAM5.20 | RAM2.20 67.94,48.9 68.58,49.53 68.58,57.78 | 68.58,57.78 68.58,62.87 69.22,63.5 RAM6.20 | RAM4.20 19.68,48.9 20.32,49.53 20.32,58.1 | 20.32,58.1 20.32,60.33 20.95,60.96 RAM8.20 | RAM3.20 43.81,48.9 44.45,49.53 v44.45,58.1 44.45,62.87 45.09,63.5 RAM7.20 | v21.59,58.1 20.32,58.1 | v67.31,57.78 68.58,57.78 | v89.53,57.78 92.71,57.78 | v28.89,23.18 25.72,26.35 25.72,45.4 26.04,45.72 27.62,45.72 27.62,57.78 v27.3,58.1
  Bottom 0.178: v36.83,20.32 35.56,20.32 v34.92,20.95 32.7,23.18 v28.89,23.18 | v36.83,11.11 v50.16,11.11 | v21.59,58.1 v27.3,58.1 v44.45,58.1 44.77,57.78 v67.31,57.78 v89.53,57.78
D7  (via drill 0.3)
  Top 0.178: v51.12,11.11 51.12,12.38 51.44,12.7 IC6.3 51.44,13.02 50.8,13.65 v50.8,25.08 | IC2.3 v36.83,25.72 37.47,26.35 37.47,32.38 36.83,33.02 v36.83,42.23 | v18.41,45.4 RAM4.21 | v18.41,53.02 19.68,54.29 19.68,61.28 | RAM8.21 19.68,61.28 | RAM7.21 43.81,63.5 43.18,62.87 v43.18,61.28 43.18,49.53 42.55,48.9 RAM3.21 v42.55,42.86 | v66.67,42.86 RAM2.21 | v67.31,61.28 67.31,62.87 67.94,63.5 RAM6.21 | v90.81,45.4 RAM1.21 | v91.44,61.91 91.44,62.87 92.08,63.5 RAM5.21 | v20.32,61.28 19.68,61.28
  Bottom 0.178: v51.12,11.11 50.48,11.75 34.61,11.75 33.02,10.16 33.02,7.94 34.92,7.94 36.2,6.67 JP1.D7 | v36.83,25.72 47.94,25.72 48.58,25.08 v50.8,25.08 | v18.41,45.4 13.97,49.85 13.97,53.02 v18.41,53.02 | v90.81,45.4 88.27,42.86 v66.67,42.86 v42.55,42.86 37.47,42.86 v36.83,42.23 | v91.44,61.91 90.81,61.28 v67.31,61.28 v43.18,61.28 v20.32,61.28
GND  (via drill 0.3)
  Top 0.406: RAM5.16 97.16,35.56 95.89,34.29 RAM1.16 95.89,25.72 93.98,23.81 IC5.8 93.98,23.5 93.66,23.18 v93.66,21.91 | IC3.10 76.83,13.02 76.52,12.7 76.52,10.16 80.01,10.16 84.77,14.92 84.77,18.73 81.92,18.73 80.01,20.64 v80.01,22.54 80.01,27.62 81.28,28.89 C15.2 | 62.23,24.45 57.78,24.45 IC4.8 | 69.22,25.4 67.94,25.4 IC3.18 | 69.22,25.4 70.48,25.4 | 69.22,25.4 IC3.17 v69.22,22.54 | 73.34,48.58 73.03,48.9 RAM6.16 | 73.34,48.58 73.98,47.94 | 73.98,47.94 74.93,46.99 C1.2 | 73.98,47.94 73.98,63.18 76.2,63.18 C5.2 | 73.34,48.58 73.34,35.88 71.75,34.29 RAM2.16 71.75,33.02 71.44,32.7 71.44,27.3 70.8,26.67 70.8,25.72 70.48,25.4 | 70.48,25.4 IC3.16 | v63.18,23.5 62.23,24.45 | 62.23,24.45 C9.2 | 25.08,48.58 26.67,46.99 C3.2 | 25.08,48.58 25.08,50.16 24.77,50.48 RAM8.16 24.77,60.01 27.94,63.18 C7.2 | 25.08,48.58 25.08,35.88 23.5,34.29 RAM4.16 23.5,33.97 25.08,32.38 25.08,26.04 29.84,21.27 | C8.2 3.81,63.18 2.54,61.91 C4.2 2.54,46.67 1.27,45.4 1.27,33.34 13.65,20.95 v15.24,20.95 20.95,20.95 | 29.84,21.27 29.84,28.26 31.11,29.53 C11.2 | 29.84,21.27 29.84,19.05 30.48,18.41 C13.2 30.48,18.1 28.57,16.19 28.57,13.97 26.35,13.97 20.95,19.37 20.95,20.95 | 20.95,20.95 IC7.7 | C6.2 52.07,63.18 48.9,60.01 RAM7.16 48.9,48.9 50.8,46.99 C2.2 50.8,46.67 47.94,43.81 47.94,34.61 47.62,34.29 RAM3.16 47.62,30.48 46.35,29.21 C10.2 46.35,28.89 42.86,25.4 | 41.59,15.24 42.55,14.29 IC1.8 | 41.59,15.24 41.27,15.56 | 41.27,15.56 40.32,16.51 40.32,18.41 40.01,18.73 IC1.11 | 44.77,20.64 43.18,22.23 IC2.8 43.18,25.08 42.86,25.4 | 44.77,20.64 45.4,20 | 45.4,20 46.35,19.05 C12.2 | 42.86,25.4 40.96,27.3 40.96,29.21 40.64,29.53 IC2.11
  Top 0.406: 41.27,15.56 45.4,19.68 45.4,20 | v8.89,27.3 8.89,28.26 10.16,29.53 C14.2 | v58.74,13.02 57.78,13.02 IC6.8 | v40.64,14.29 41.59,15.24 | 44.77,20.64 v47.31,23.18
  Bottom 0.406: v93.66,21.91 93.03,22.54 v80.01,22.54 v69.22,22.54 64.14,22.54 v63.18,23.5 62.23,22.54 59.05,22.54 58.42,23.18 v47.31,23.18 | v8.89,27.3 v15.24,20.95 22.86,13.34 27.94,13.34 28.26,13.02 | 28.26,13.02 31.11,10.16 31.11,7.3 | 28.26,13.02 40.64,13.02 | 40.64,13.02 v58.74,13.02 | JP1.GND2 33.66,7.3 31.11,7.3 | 31.11,7.3 JP1.GND1 | 40.64,13.02 v40.64,14.29
  pour Top: -1.91,67.31 -1.91,-0.64 102.23,-0.64 102.23,67.31
N$1  (via drill 0.3)
  Top 0.178: IC1.12 v38.73,22.23 38.73,28.89 39.37,29.53 IC2.12 | v68.26,27.94 69.53,29.21 R1.2 | v54.61,27.94 53.98,28.57 IC4.12 | v16.51,25.08 16.51,24.45 15.88,23.81 IC7.3 | v57.15,25.08 57.15,17.46 54.93,17.46 54.61,17.78 54.61,18.1 53.98,18.73 IC6.12
  Bottom 0.178: v54.61,27.94 58.74,27.94 | 58.74,27.94 v68.26,27.94 | v16.51,25.08 17.78,23.81 38.73,23.81 | 38.73,23.81 54.61,23.81 56.52,25.72 | 58.74,27.94 56.52,25.72 | 56.52,25.72 v57.15,25.08 | 38.73,23.81 v38.73,22.23
N$2  (via drill 0.3)
  Top 0.178: v87.63,35.88 IC5.14 | RAM2.22 v65.41,36.2
  Bottom 0.178: v87.63,35.88 87,35.24 66.36,35.24 v65.41,36.2
N$3  (via drill 0.3)
  Top 0.178: v90.17,35.88 90.17,33.02 89.53,32.38 89.53,30.48 88.9,29.84 IC5.13 | v40.64,36.51 40.64,45.09 41.27,45.72 RAM3.22
  Bottom 0.178: v90.17,35.88 89.22,36.83 63.5,36.83 61.91,35.24 41.91,35.24 v40.64,36.51
N$4  (via drill 0.3)
  Top 0.178: v91.44,35.88 91.44,32.07 90.81,31.43 90.81,30.48 90.17,29.84 IC5.12 | v18.1,35.88 17.78,35.56 17.78,32.07 17.46,31.75 16.51,31.75 16.51,45.09 17.14,45.72 RAM4.22
  Bottom 0.178: v91.44,35.88 90.17,34.61 19.37,34.61 v18.1,35.88
N$5
  Top 0.178: RAM5.22 90.81,65.09 97.47,65.09 97.79,64.77 97.79,21.27 93.34,21.27 92.08,22.54 92.08,28.89 91.44,29.53 IC5.11
N$6  (via drill 0.3)
  Top 0.178: IC5.10 92.71,31.75 93.98,33.02 93.98,43.81 95.25,45.09 v95.25,48.58 | v67.63,53.02 66.67,53.98 RAM6.22
  Bottom 0.178: v95.25,48.58 92.08,51.75 68.9,51.75 v67.63,53.02
N$7
  Top 0.178: JP1.SW2 28.89,4.13 28.89,6.99 29.21,7.3 31.11,7.3 JP1.SW1
N$8  (via drill 0.3)
  Top 0.178: v45.09,29.84 43.18,29.84 IC2.9 | v62.23,29.84 62.87,29.21 v62.87,26.67 | v83.19,25.72 85.09,23.81 IC5.1
  Bottom 0.178: v62.23,29.84 v45.09,29.84 | v62.87,26.67 63.82,25.72 v83.19,25.72
N$9  (via drill 0.3)
  Top 0.178: v41.91,17.46 IC2.7 | v76.52,20.32 76.2,20 76.2,13.02 75.88,12.7 75.88,9.84 76.52,9.21 83.82,9.21 83.82,13.34 86.04,15.56 86.04,23.18 86.36,23.5 IC5.2
  Bottom 0.178: v41.91,17.46 70.48,17.46 73.34,20.32 v76.52,20.32
N$10  (via drill 0.3)
  Top 0.178: v41.27,22.23 41.27,22.86 40.64,23.5 IC2.6 | v86.68,20.95 87.63,21.91 IC5.3
  Bottom 0.178: v41.27,22.23 41.59,22.54 58.42,22.54 60.01,20.95 v86.68,20.95
N$11  (via drill 0.3)
  Top 0.178: v93.34,31.43 93.34,30.48 93.98,29.84 IC5.9 | v41.91,57.47 42.55,58.1 RAM7.22
  Bottom 0.178: v93.34,31.43 90.81,33.97 19.05,33.97 16.51,36.51 8.89,36.51 5.08,40.32 5.08,57.47 v41.91,57.47
N$12  (via drill 0.3)
  Top 0.178: v95.25,41.91 95.25,29.21 93.34,27.3 93.34,24.45 92.71,23.81 IC5.7 | v17.78,49.21 17.78,62.87 18.41,63.5 RAM8.22
  Bottom 0.178: v95.25,41.91 90.49,46.67 20.32,46.67 v17.78,49.21
N$13  (via drill 0.3)
  Top 0.178: IC7.5 18.41,22.23 15.56,22.23 15.24,22.54 15.24,22.86 14.61,23.5 IC7.2 14.61,23.81 15.24,24.45 v15.24,32.38 | IC3.19 66.67,28.57 67.31,29.21 R1.1 67.63,29.21 v69.85,31.43
  Bottom 0.178: v15.24,32.38 16.51,33.66 18.73,33.66 19.05,33.34 90.81,33.34 91.44,32.7 91.44,31.43 v69.85,31.43
N$26  (via drill 0.3)
  Top 0.178: IC5.15 86.36,39.69 87,40.32 v87,40.64 | RAM1.22 v89.53,43.18
  Bottom 0.178: v89.53,43.18 v87,40.64
VCC  (via drill 0.3)
  Top 0.406: C10.1 46.35,26.99 48.9,29.53 IC4.16 48.9,29.84 49.21,30.16 49.21,42.86 50.8,44.45 C2.1 50.8,44.77 52.7,46.67 RAM2.32 52.7,47.31 52.07,47.94 C6.1 52.07,61.28 53.98,63.18 RAM6.32 53.98,63.82 53.34,63.82 52.07,65.09 29.84,65.09 | C4.1 2.54,44.77 4.45,46.67 RAM4.32 4.45,47.31 3.81,47.94 C8.1 3.81,61.28 5.71,63.18 RAM8.32 5.71,63.82 6.03,64.14 6.03,64.77 6.35,65.09 29.84,65.09 | 28.26,61.59 29.84,63.18 RAM7.32 29.84,65.09 | 28.26,61.59 27.94,61.28 C7.1 28.26,61.59 | 28.26,61.59 28.26,47.62 28.57,47.31 RAM3.32 28.57,44.77 26.67,44.77 C3.1 26.67,44.45 26.35,44.13 v26.35,28.57 | IC3.9 v75.56,19.37 IC3.12 75.56,44.77 | 75.56,44.77 76.83,44.77 RAM1.32 76.83,47.31 76.52,47.62 76.52,58.1 76.2,58.42 C5.1 76.2,61.28 78.11,61.28 RAM5.32 | 75.56,44.77 74.93,44.77 C1.1 75.56,44.77 | IC2.16 34.29,29.84 33.34,29.84 31.11,27.62 C11.1 31.11,27.3 31.75,26.67 31.75,16.19 | 31.75,16.19 33.66,16.19 v33.66,17.46 IC1.16 | 31.75,16.19 30.48,16.19 C13.1 30.48,14.92 v27.94,12.38 | 85.09,26.99 81.28,26.99 C15.1 v81.28,20.32 | IC5.16 85.09,26.99 | 85.09,26.99 88.9,26.99 91.12,24.77 91.12,24.13 91.44,23.81 IC5.6 | IC3.14 IC3.7 73.03,13.65 71.44,13.65 70.8,14.29 70.8,14.92 70.48,15.24 IC3.5 v70.48,16.83 | IC3.20 65.41,24.45 65.09,24.13 65.09,22.54 62.23,22.54 C9.1 v62.23,16.83 | 13.34,27.62 10.16,27.62 C14.1 | IC7.14 13.34,27.62 | v47.62,16.83 46.35,16.83 C12.1 | IC6.16 v48.9,16.83 | v67.94,16.83 IC3.3 | v13.34,27.3 13.34,27.62
  Bottom 0.406: JP1.+5V1 26.04,7.3 27.94,7.3 | 27.94,7.3 28.57,6.67 JP1.+5V2 | v81.28,20.32 80.33,19.37 v75.56,19.37 73.03,19.37 v70.48,16.83 v67.94,16.83 v62.23,16.83 v48.9,16.83 v47.62,16.83 47.31,16.51 38.1,16.51 37.15,17.46 v33.66,17.46 23.18,17.46 v13.34,27.3 25.08,27.3 v26.35,28.57 | v27.94,12.38 27.94,7.3
  pour Bottom: -3.81,68.58 -3.81,-2.54 104.14,-2.54 104.14,68.58

### Text on the board
tNames: Board Rev.2 | 8bits4ever 2016 | MSX MEGA-MAPPER